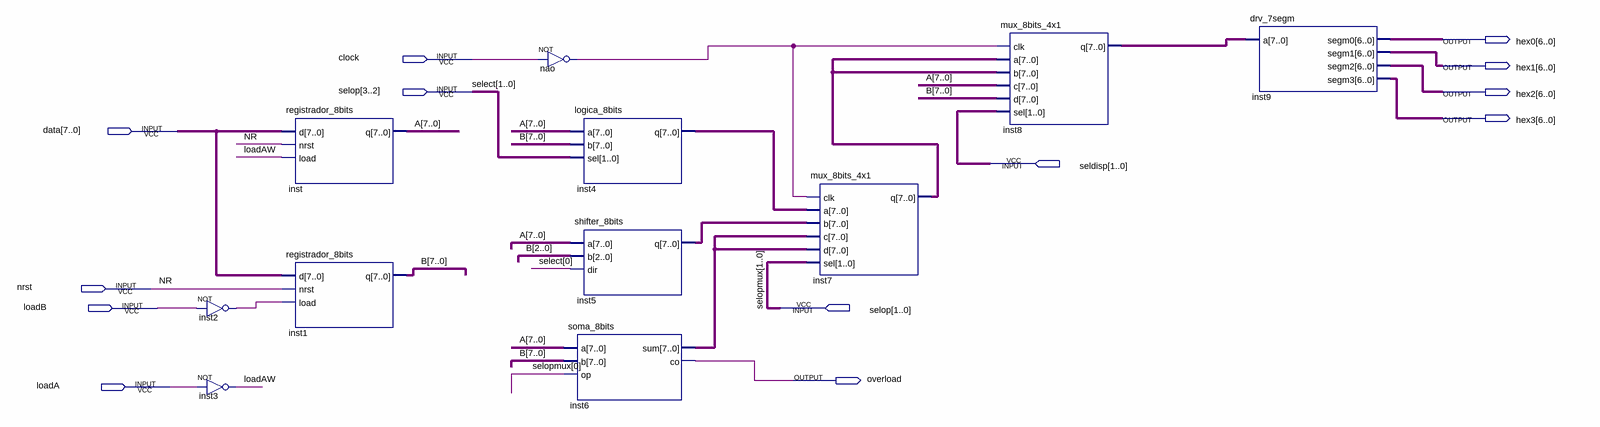
[diagram p0: schematic sheet]
// Quartus schematic myULA_top.bdf as structural Verilog: 11 symbols, 13 pins
module myULA_top (
  input  clock,
  input  [3:0] selop,
  input  [7:0] data,
  input  [1:0] seldisp,
  input  nrst,
  input  loadB,
  input  loadA,
  output [6:0] hex0,
  output [6:0] hex1,
  output [6:0] hex2,
  output [6:0] hex3,
  output overload
);

  wire inst2_out, loadAW, nao_out;
  wire [7:0] A, B, inst4_q, inst5_q, inst6_sum, inst7_q, inst8_q;

  not inst2 (inst2_out, loadB);
  not inst3 (loadAW, loadA);
  registrador_8bits inst (.d(data), .nrst(nrst), .load(loadAW), .q(A));
  registrador_8bits inst1 (.d(data), .nrst(nrst), .load(inst2_out), .q(B));
  not nao (nao_out, clock);
  logica_8bits inst4 (.a(A), .b(B), .sel(selop[3:2]), .q(inst4_q));
  shifter_8bits inst5 (.a(A), .b(B[2:0]), .dir(selop[2]), .q(inst5_q));
  soma_8bits inst6 (.a(A), .b(B), .op(selop[0]), .sum(inst6_sum), .co(overload));
  mux_8bits_4x1 inst7 (
    .clk(nao_out), .a(inst4_q), .b(inst5_q), .c(inst6_sum), .d(inst6_sum), .sel(selop[1:0]), .q(inst7_q));
  mux_8bits_4x1 inst8 (.clk(nao_out), .a(inst7_q), .b(inst7_q), .c(A), .d(B), .sel(seldisp), .q(inst8_q));
  drv_7segm inst9 (.a(inst8_q), .segm0(hex0), .segm1(hex1), .segm2(hex2), .segm3(hex3));

  // Other names for the same wires on the sheet: NR = nrst; select[1:0] = selop[3:2]; selopmux[1:0] = selop[1:0]
endmodule
